# Altium schematic sheet LTC6362_Schematic_2.SchDoc
size A; SheetNumber: 16; SheetTotal: 16
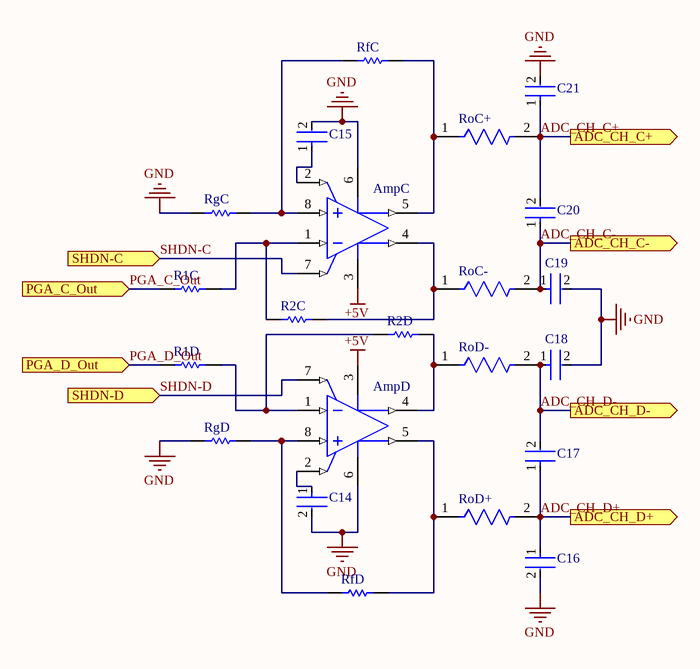
[diagram p0: LTC6362_Schematic_2.SchDoc]

## Parts
AmpC  LTC6362HMS8#PBF  [LT-MS8-8_L]  (value not drawn)
AmpD  LTC6362HMS8#PBF  [LT-MS8-8_L]  (value not drawn)
C14  GQM1875C2ER10BB12D  [FP-GQM187-0_15-MFG]  (value not drawn)
C15  GQM1875C2ER10BB12D  [FP-GQM187-0_15-MFG]  (value not drawn)
C16  CC0603KRX7R9BB392  [FP-CC0603-DA-MFG]  (value not drawn)
C17  CC0603KRX7R9BB392  [FP-CC0603-DA-MFG]  (value not drawn)
C18  CC0603KRX7R9BB392  [FP-CC0603-DA-MFG]  (value not drawn)
C19  CC0603KRX7R9BB392  [FP-CC0603-DA-MFG]  (value not drawn)
C20  CC0603KRX7R9BB392  [FP-CC0603-DA-MFG]  (value not drawn)
C21  CC0603KRX7R9BB392  [FP-CC0603-DA-MFG]  (value not drawn)
R1C  ERJ-6ENF1241V  [RESC2013X70X40LL20T20]  (value not drawn)
R1D  ERJ-6ENF1241V  [RESC2013X70X40LL20T20]  (value not drawn)
R2C  RC0805FR-071KL  [RESC2013X60X35ML10T20]  (value not drawn)
R2D  RC0805FR-071KL  [RESC2013X60X35ML10T20]  (value not drawn)
RfC  RC0805FR-071KL  [RESC2013X60X35ML10T20]  (value not drawn)
RfD  RC0805FR-071KL  [RESC2013X60X35ML10T20]  (value not drawn)
RgC  ERJ-6ENF1241V  [RESC2013X70X40LL20T20]  (value not drawn)
RgD  ERJ-6ENF1241V  [RESC2013X70X40LL20T20]  (value not drawn)
RoC+  CRCW060335K7FKEA  [FP-CRCW0603-e3-IPC_C]  (value not drawn)
RoC-  CRCW060335K7FKEA  [FP-CRCW0603-e3-IPC_C]  (value not drawn)
RoD+  CRCW060335K7FKEA  [FP-CRCW0603-e3-IPC_C]  (value not drawn)
RoD-  CRCW060335K7FKEA  [FP-CRCW0603-e3-IPC_C]  (value not drawn)

## Ports
ADC_CH_C+ (out), ADC_CH_C- (out), ADC_CH_D+ (out), ADC_CH_D- (out), PGA_C_Out (in), PGA_D_Out (in), SHDN-C (in), SHDN-D (in)

## Nets
+5V: AmpC.3(V+) AmpD.3(V+)
GND: AmpC.6(V-) AmpD.6(V-) C14.2 C15.2 C16.2 C18.2 C19.2 C21.2 RgC.1 RgD.1
ADC_CH_C+: C20.2 C21.1 RoC+.2 ; port ADC_CH_C+
ADC_CH_C-: C19.1 C20.1 RoC-.2 ; port ADC_CH_C-
ADC_CH_D+: C16.1 C17.1 RoD+.2 ; port ADC_CH_D+
ADC_CH_D-: C17.2 C18.1 RoD-.2 ; port ADC_CH_D-
PGA_C_Out: R1C.1 ; port PGA_C_Out
PGA_D_Out: R1D.1 ; port PGA_D_Out
SHDN-C: AmpC.7(~{SHDN}) ; port SHDN-C
SHDN-D: AmpD.7(~{SHDN}) ; port SHDN-D
NetAmpC_1: AmpC.1(-IN) R1C.2 R2C.1
NetAmpC_2: AmpC.2(VOCM) C15.1
NetAmpC_4: AmpC.4(+OUT) R2C.2 RoC-.1
NetAmpC_5: AmpC.5(-OUT) RfC.2 RoC+.1
NetAmpC_8: AmpC.8(+IN) RfC.1 RgC.2
NetAmpD_1: AmpD.1(-IN) R1D.2 R2D.1
NetAmpD_2: AmpD.2(VOCM) C14.1
NetAmpD_4: AmpD.4(+OUT) R2D.2 RoD-.1
NetAmpD_5: AmpD.5(-OUT) RfD.2 RoD+.1
NetAmpD_8: AmpD.8(+IN) RfD.1 RgD.2

## Library data of the parts
AmpC AmpD = CMP-0359-00920-2: Single Channel, Precision, Low Power Differential Operational Amplifier / SAR ADC Driver, RRIO, 180 MHz Typical GBW, 45 V/us Typical SR, 2.8 to 5.25 V, 8-Pin SOP (MS8-8), High Temperature / Automotive, Pb-Free; Manufacturer: Linear Technology; Vs Max (V): 5.25; Is (mA) Typical: 0.9; SR (V/us) Typical: 45; Channels (#): 1; GBW (MHz) Typical: 180; Vos (mV) Typical: 0.05; Vs Min (V): 2.8; PartNumber: LTC6362HMS8#PBF; PackageDescription: 8-Lead Plastic Small Outline, Body 3.9 x 4.9 mm, Pitch 1.27 mm; ComponentLink2Description: Datasheet; ComponentLink3URL: http://cds.linear.com/docs/en/packaging/05081610_G_SO8.pdf; ComponentLink1Description: Manufacturer URL; PackageReference: LT-MS8-8; ComponentLink2URL: http://cds.linear.com/docs/en/datasheet/6362fa.pdf; PackageVersion: Rev G; Mounting Technology: Surface Mount; Linear Technology Part Number: LTC6362; DatasheetVersion: Rev. A; RevisionNote: URLs updated; RoHS: Pb-Free; ComponentLink1URL: http://www.linear.com/; Type: DIFF; ComponentLink3Description: Package Specification
C14 C15 = CMP-06035-052255-1: Ceramic Capacitor 0.1pF ±0.1pF 250VDC C0G 0603 Paper T/R; Voltage Rating: 250V; Width: 0.031inch; Length: 1.6mm; Max Operating Temperature: 125°C; Min Operating Temperature: -55°C; Height: 0.7mm; Dielectric: C0G; Termination: SMD/SMT; Depth: 0.8mm; Case/Package: 0603; Package Quantity: 4000; Radiation Hardening: No; Case Code (Metric): 1608; Thickness: 0.031inch; Capacitance: 0.1pF; Case Code (Imperial): 0603; Voltage Rating (DC): 250V; Packaging: Tape and Reel; Mount: Surface Mount
C16-C21 = CMP-03422-000635-2: CAP CER 3900PF 50V X7R 0603; Tolerance: 10%; Dielectric Material: Ceramic; Capacitance: 3.9nF; Insulation Resistance: 100GR; Height: 0.8mm; Voltage Rating: 50V; Termination: SMD/SMT; REACH SVHC: No SVHC; Resistor Type: Ceramic; Radiation Hardening: No; Case Code (Imperial): 0603; Voltage: 50V; Series: CC; Mount: Surface Mount; Length: 1.6mm; RoHS Compliant: Yes; Lead Free: Lead Free; Width: 0.8mm; Package Quantity: 4000; Packaging: Tape and Reel; Dielectric: X7R; Voltage Rating (DC): 50V; Min Operating Temperature: -55°C; Depth: 0.8mm; Halogen Free: Halogen Free; Case/Package: 0603; Thickness: 0.035inch; Number of Pins: 2; Max Operating Temperature: 125°C; Case Code (Metric): 1608; Construction: Flat
R1C R1D RgC RgD = CMP-2001-04406-1: Manufacturer: Panasonic; Part Number: ERJ-6ENF1241V
R2C R2D RfC RfD = CMP-2100-03671-1: Chip Resistor, 1 KOhm, +/- 1%, 125 mW, -55 to 155 degC, 0805 (2012 Metric), RoHS, Tape and Reel; Manufacturer: Yageo; Temperature Coefficient: 100ppm/degreesC; Voltage Rating (DC): 150V; Max Power Dissipation: 125mW; Resistance: 1KOhm; Number of Pins: 2; Number of Terminations: 2; Datasheet URL: http://www.yageo.com/NewPortal/yageodocoutput?fileName=/pdf/R-Chip/PYu-RC_Group_51_RoHS_L_5.pdf; Length: 0.079inch; Package Description: 2-Pin Surface Mounted Device, Body 2 x 1.25 mm; Depth: 1.25mm; Height: 0.024inch; Military Standard: Not; Case/Package: 0805; Package Reference: 0805; RoHSCompliant: true; Lead Free: LeadFree; Packaging: TapeandReel; Package Quantity: 1; Datasheet Version: Rev. 5, 10/2016; Tolerance: 1%; Min Operating Temperature: -55degC; Voltage Rating: 150V; Composition: ThickFilm; Case Code (Imperial): 0805; Power Rating: 125mW; Width: 0.049inch; Case Code (Metric): 2012; Manufacturer URL: http://www.yageo.com/; Max Operating Temperature: 155degC; REACH SVHC: Unknown; Termination: SMD/SMT
RoC+ RoC- RoD+ RoD- = CMP-2000-03264-2: RES Thick Film, 35.7kΩ, 1%, 0.1W, 100ppm/°C, 0603; Max Power Dissipation: 100mW; Voltage Rating: 75V; Resistance: 35.7kR; Weight: 7.1E-05oz; Termination: Solder; Max Operating Temperature: 155°C; Military Standard: Not; Height: 0.45mm; Temperature Coefficient: 100ppm/°C; Contact Plating: Tin; Packaging: Tape and Reel; Radiation Hardening: No; Depth: 0.85mm; Number of Pins: 2; Length: 1.55mm; Composition: Thick Film; Case Code (Metric): 1608; Package Quantity: 10; Width: 0.033inch; Number of Terminations: 2; Power Rating: 100mW; Case/Package: 0603; Case Code (Imperial): 0603; Features: Automotive AEC-Q200; Tolerance: 1%; Min Operating Temperature: -55°C